# Altium schematic sheet audio-streamer.SCHDOC
size B
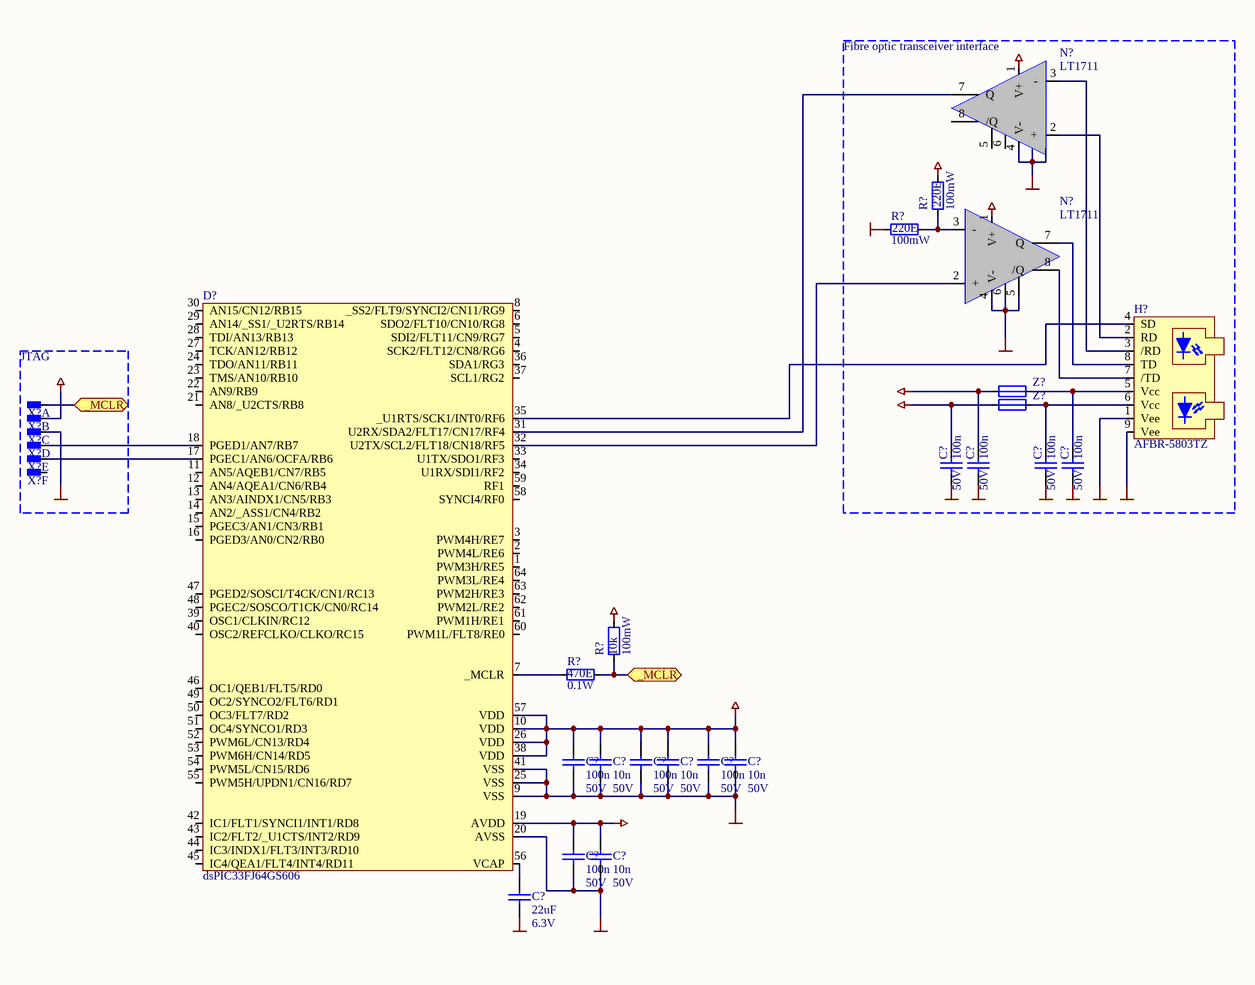
[diagram p0: audio-streamer.SCHDOC]

## Parts
(Parts that share a designator on the sheet are numbered #1, #2 ... from top to bottom, then left to right.)
C?#1  value 100n  Value2: 50V  [SMD_0603]  (hidden comment: C_SMD_CER_100N_50V_10%_X7R_0603)
C?#2  value 100n  Value2: 50V  [SMD_0603]  (hidden comment: C_SMD_CER_100N_50V_10%_X7R_0603)
C?#3  value 100n  Value2: 50V  [SMD_0603]  (hidden comment: C_SMD_CER_100N_50V_10%_X7R_0603)
C?#4  value 100n  Value2: 50V  [SMD_0603]  (hidden comment: C_SMD_CER_100N_50V_10%_X7R_0603)
C?#5  value 100n  Value2: 50V  [SMD_0603]  (hidden comment: C_SMD_CER_100N_50V_10%_X7R_0603)
C?#6  value 10n  Value2: 50V  [SMD_0603]  (hidden comment: C_SMD_CER_10N_50V_10%_X7R_0603)
C?#7  value 100n  Value2: 50V  [SMD_0603]  (hidden comment: C_SMD_CER_100N_50V_10%_X7R_0603)
C?#8  value 10n  Value2: 50V  [SMD_0603]  (hidden comment: C_SMD_CER_10N_50V_10%_X7R_0603)
C?#9  value 100n  Value2: 50V  [SMD_0603]  (hidden comment: C_SMD_CER_100N_50V_10%_X7R_0603)
C?#10  value 10n  Value2: 50V  [SMD_0603]  (hidden comment: C_SMD_CER_10N_50V_10%_X7R_0603)
C?#11  value 100n  Value2: 50V  [SMD_0603]  (hidden comment: C_SMD_CER_100N_50V_10%_X7R_0603)
C?#12  value 10n  Value2: 50V  [SMD_0603]  (hidden comment: C_SMD_CER_10N_50V_10%_X7R_0603)
C?#13  value 22uF  Value2: 6.3V  [SMD_1206]  (hidden comment: C_SMD_CER_22U_6V3_20%_X5R_1206)
D?  Type: dsPIC33FJ64GS606  [SMD_TQFP-64]  (hidden comment: D_DSPIC33FJ64GS606_TQFP-64)
H?  Type: AFBR-5803TZ  [THT_AFBR-5803TZ]  (hidden comment: H_OPTO_TRANSCEIVER_ST_3V3_100MBPS_1300NM)
N?#1  Type: LT1711  [SMD_SOP_8]  (hidden comment: N_LT1711_SOP-8)
N?#2  Type: LT1711  [SMD_SOP_8]  (hidden comment: N_LT1711_SOP-8)
R?#1  value 220E  Value2: 100mW  [SMD_0603]  (hidden comment: R_SMD_THINFILM_220E_0W1_1%_50PPM_0603)
R?#2  value 220E  Value2: 100mW  [SMD_0603]  (hidden comment: R_SMD_THINFILM_220E_0W1_1%_50PPM_0603)
R?#3  value 10k  Value2: 100mW  [SMD_0603]  (hidden comment: R_SMD_THINFILM_10K_0W1_1%_50PPM_0603)
R?#4  value 470E  Value2: 0.1W  [SMD_0603]  (hidden comment: R_SMD_THINFILM_470E_0W1_1%_50PPM_0603)
X?#1  X_CONNECTOR_P2.54_D0.9_1X6  [THT_CON_P2.54_D0.9_1X6]  (value not drawn)  (part A of 6)
X?#2  X_CONNECTOR_P2.54_D0.9_1X6  [THT_CON_P2.54_D0.9_1X6]  (value not drawn)  (part B of 6)
X?#3  X_CONNECTOR_P2.54_D0.9_1X6  [THT_CON_P2.54_D0.9_1X6]  (value not drawn)  (part C of 6)
X?#4  X_CONNECTOR_P2.54_D0.9_1X6  [THT_CON_P2.54_D0.9_1X6]  (value not drawn)  (part D of 6)
X?#5  X_CONNECTOR_P2.54_D0.9_1X6  [THT_CON_P2.54_D0.9_1X6]  (value not drawn)  (part E of 6)
X?#6  X_CONNECTOR_P2.54_D0.9_1X6  [THT_CON_P2.54_D0.9_1X6]  (value not drawn)  (part F of 6)
Z?#1  Z_SMD_FERRITE_1A5_470E@100MHZ_0603  [SMD_0603]  (value not drawn)
Z?#2  Z_SMD_FERRITE_1A5_470E@100MHZ_0603  [SMD_0603]  (value not drawn)

## Blocks framed on the sheet
Fibre optic transceiver interface: C?#1-C?#4 H? N?#1 N?#2 R?#1 R?#2 Z?#1 Z?#2
JTAG: X?#1-X?#6

## Ports
_MCLR

## Nets
+3.3V: C?#1.1 C?#3.2 C?#5.2 C?#6.2 C?#7.2 C?#8.2 C?#9.2 C?#10.2 C?#11.2 C?#12.2 D?.10(VDD) D?.19(AVDD) D?.26(VDD) D?.38(VDD) D?.57(VDD) N?#1.1(V+) N?#2.1(V+) R?#1.2 R?#3.2 X?#2.2 Z?#1.2 Z?#2.2
GND: C?#1.2 C?#2.2 C?#3.1 C?#4.1 C?#5.1 C?#6.1 C?#7.1 C?#8.1 C?#9.1 C?#10.1 C?#11.1 C?#12.1 C?#13.1 D?.9(VSS) D?.20(AVSS) D?.25(VSS) D?.41(VSS) H?.1(Vee) H?.9(Vee) N?#1.4(V-) N?#2.4(V-) N?#2.5(LATCH_ENABLE) N?#2.6(GND) R?#2.1 X?#3.3
_MCLR: R?#3.1 R?#4.1 X?#1.1 ; port _MCLR
NetC?#2_1: C?#2.1 H?.5(Vcc) Z?#1.1
NetC?#4_2: C?#4.2 H?.6(Vcc) Z?#2.1
NetC?#13_2: C?#13.2 D?.56(VCAP)
NetD?_7: D?.7(_MCLR) R?#4.2
NetD?_17: D?.17(PGEC1/AN6/OCFA/RB6) X?#5.5
NetD?_18: D?.18(PGED1/AN7/RB7) X?#4.4
NetD?_31: D?.31(U2RX/SDA2/FLT17/CN17/RF4) N?#1.7(Q)
NetD?_32: D?.32(U2TX/SCL2/FLT18/CN18/RF5) N?#2.2(+)
NetD?_35: D?.35(_U1RTS/SCK1/INT0/RF6) H?.4(SD)
NetH?_2: H?.2(RD) N?#1.2(+)
NetH?_3: H?.3(/RD) N?#1.3(-)
NetH?_7: H?.7(/TD) N?#2.8(/Q)
NetH?_8: H?.8(TD) N?#2.7(Q)
NetN?#2_3: N?#2.3(-) R?#1.1 R?#2.2

Not connected (* = marked no-connect by the designer): D? 1(PWM3H/RE5) 2(PWM4L/RE6) 3(PWM4H/RE7) 4(SCK2/FLT12/CN8/RG6) 5(SDI2/FLT11/CN9/RG7) 6(SDO2/FLT10/CN10/RG8) 8(_SS2/FLT9/SYNCI2/CN11/RG9) 11(AN5/AQEB1/CN7/RB5) 12(AN4/AQEA1/CN6/RB4) 13(AN3/AINDX1/CN5/RB3) 14(AN2/_ASS1/CN4/RB2) 15(PGEC3/AN1/CN3/RB1) 16(PGED3/AN0/CN2/RB0) 21(AN8/_U2CTS/RB8) 22(AN9/RB9) 23(TMS/AN10/RB10) 24(TDO/AN11/RB11) 27(TCK/AN12/RB12) 28(TDI/AN13/RB13) 29(AN14/_SS1/_U2RTS/RB14) 30(AN15/CN12/RB15) 33(U1TX/SDO1/RF3) 34(U1RX/SDI1/RF2) 36(SDA1/RG3) 37(SCL1/RG2) 39(OSC1/CLKIN/RC12) 40(OSC2/REFCLKO/CLKO/RC15) 42(IC1/FLT1/SYNCI1/INT1/RD8) 43(IC2/FLT2/_U1CTS/INT2/RD9) 44(IC3/INDX1/FLT3/INT3/RD10) 45(IC4/QEA1/FLT4/INT4/RD11) 46(OC1/QEB1/FLT5/RD0) 47(PGED2/SOSCI/T4CK/CN1/RC13) 48(PGEC2/SOSCO/T1CK/CN0/RC14) 49(OC2/SYNCO2/FLT6/RD1) 50(OC3/FLT7/RD2) 51(OC4/SYNCO1/RD3) 52(PWM6L/CN13/RD4) 53(PWM6H/CN14/RD5) 54(PWM5L/CN15/RD6) 55(PWM5H/UPDN1/CN16/RD7) 58(SYNCI4/RF0) 59(RF1) 60(PWM1L/FLT8/RE0) 61(PWM1H/RE1) 62(PWM2L/RE2) 63(PWM2H/RE3) 64(PWM3L/RE4); N?#1 5(LATCH_ENABLE) 6(GND) 8(/Q); X?#6 6

## Library data of the parts
C?#1-C?#5 C?#7 C?#9 C?#11 = C_SMD_CER_100N_50V_10%_X7R_0603: SMD Capacitor; Supplier - E+H-flowtec SAP: 50092748
C?#6 C?#8 C?#10 C?#12 = C_SMD_CER_10N_50V_10%_X7R_0603: SMD Capacitor; Supplier - E+H-flowtec SAP: 50092743
C?#13 = C_SMD_CER_22U_6V3_20%_X5R_1206: SMD Capacitor; Supplier - E+H-flowtec SAP: 71128390
D? = D_DSPIC33FJ64GS606_TQFP-64: 16-Bit Digital Signal Controllers with High-Speed PWM, / ADC and Comparators; Supplier - Digikey: DSPIC33FJ64GS606-I/PT-ND
N?#1 N?#2 = N_LT1711_SOP-8: Rail-to-rail Voltage Comparator; Supplier - Digikey: LT1711CMS8#PBF-ND
R?#1 R?#2 = R_SMD_THINFILM_220E_0W1_1%_50PPM_0603: SMD Resistor; Supplier - E+H-flowtec SAP: 50092678
R?#3 = R_SMD_THINFILM_10K_0W1_1%_50PPM_0603: SMD Resistor; Supplier - E+H-flowtec SAP: 50092700
R?#4 = R_SMD_THINFILM_470E_0W1_1%_50PPM_0603: SMD Resistor; Supplier - E+H-flowtec SAP: 50092681
X?#1-X?#6 = X_CONNECTOR_P2.54_D0.9_1X6: Pitch 2.54, Diameter 0.9mm, 1 row, 6 columns; Type: Pitch 2.54, Diameter 0.9mm, 1 row, 3 columns
Z?#1 Z?#2 = Z_SMD_FERRITE_1A5_470E@100MHZ_0603: FERRITE CHIP 470 OHM 1500MA 0603; Value: 1.5A; Supplier - Digikey: 490-5257-1-ND; Type: BLM18KG471SN1D
H? = H_OPTO_TRANSCEIVER_ST_3V3_100MBPS_1300NM: Supplier - Digikey: 516-1990-ND